# Altium schematic sheet CAN.SchDoc
size A4; SheetNumber: 16; SheetTotal: 29
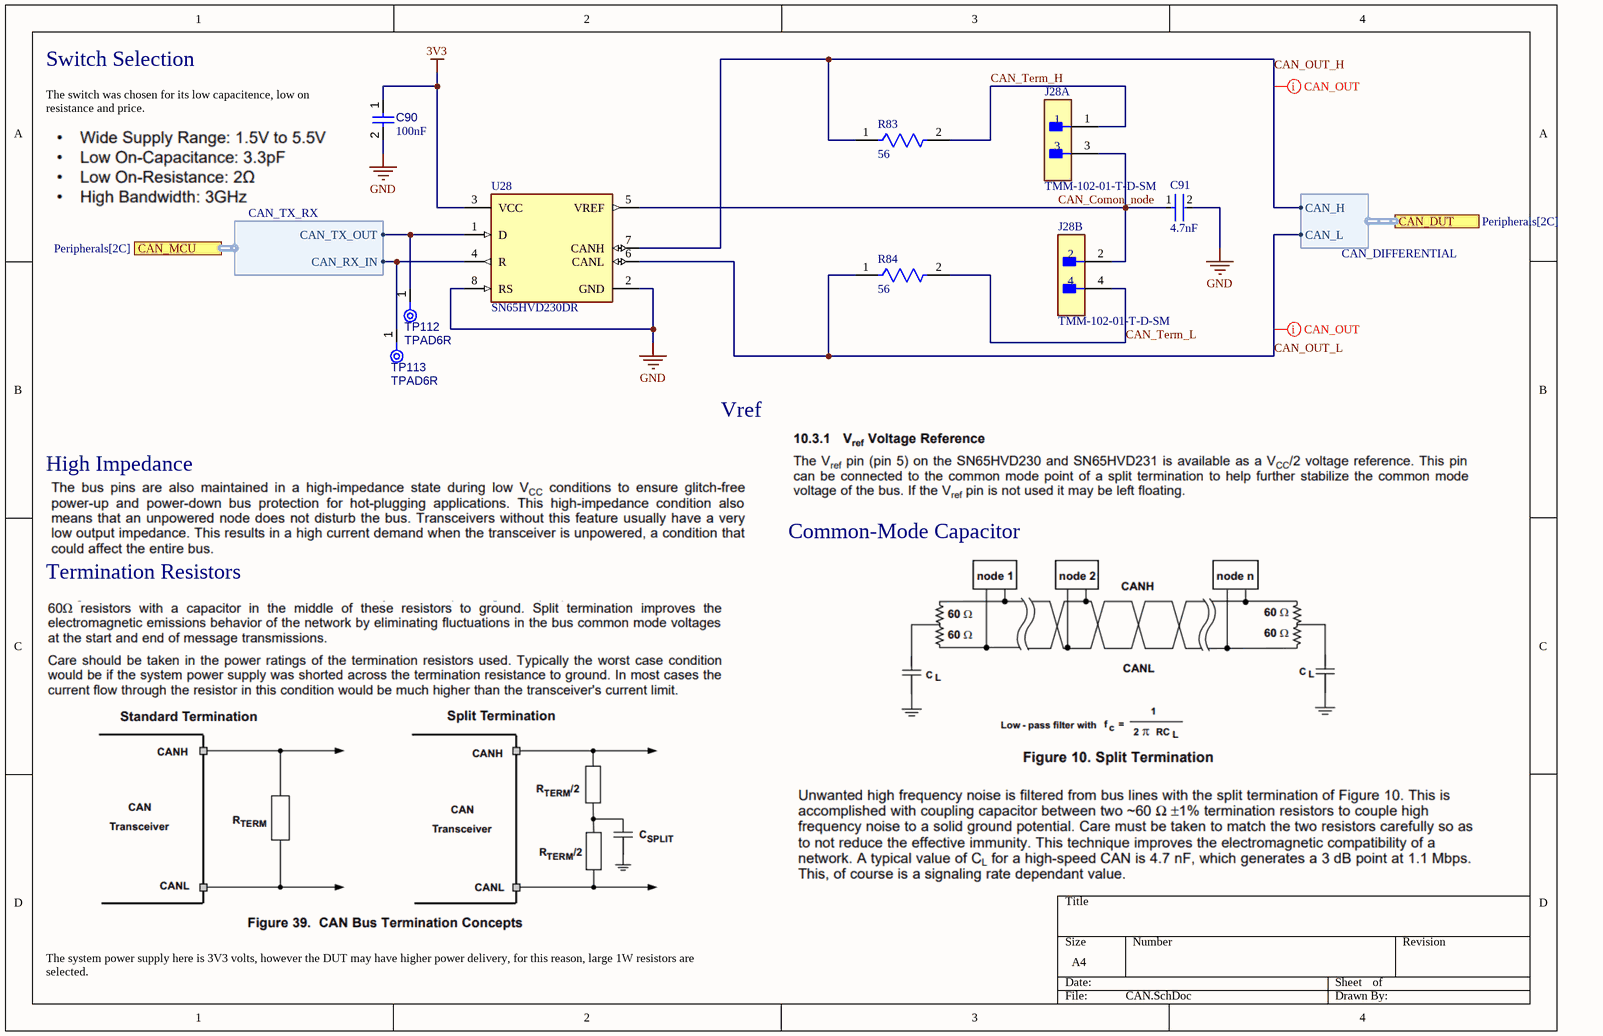
[diagram p0: CAN.SchDoc]

## Parts
C90  value 100nF  [CAPC1608X90X40NL10T20]  (hidden comment: Capacitor 100 nF +/-10% 50 V 0603)
C91  value 4.7nF  [FP-C0603C-CF-MFG]  (hidden comment: C0603C472K3GACTU)
J28  TMM-102-01-T-D-SM  [FP-TMM-102-01-T-D-SM-MFG]  (parts A,B of 2)
R83  value 56  [FP-AC2512-IPC_C]  (hidden comment: AC2512FK-0756RL)
R84  value 56  [FP-AC2512-IPC_C]  (hidden comment: AC2512FK-0756RL)
TP112  TPAD6R  [TP06R]  (no BOM)
TP113  TPAD6R  [TP06R]  (no BOM)
U28  SN65HVD230DR  [FP-D0008A-IPC_A]

## Ports
CAN_DUT (harness CAN_DIFFERENTIAL, see Peripherals[2C]), CAN_MCU (harness CAN_TX_RX, see Peripherals[2C])

## Harnesses
CAN_DIFFERENTIAL: CAN_H, CAN_L
CAN_TX_RX: CAN_TX_OUT, CAN_RX_IN

## Nets
3V3: C90.1 U28.3(VCC)
GND: C90.2 C91.2 U28.2(GND) U28.8(RS)
CAN_Comon_node: C91.1 J28.2 J28.3 U28.5(VREF)
CAN_OUT_H: R83.1 U28.7(CANH) ; port CAN_DUT.CAN_H
CAN_OUT_L: R84.1 U28.6(CANL) ; port CAN_DUT.CAN_L
CAN_Term_H: J28.1 R83.2
CAN_Term_L: J28.4 R84.2
NetTP112_1: TP112.1(TP) U28.1(D) ; port CAN_MCU.CAN_TX_OUT
NetTP113_1: TP113.1(TP) U28.4(R) ; port CAN_MCU.CAN_RX_IN

## Layout directives
differential pair; differential pair class CAN_DIFF_PAIR: CAN_OUT_H
differential pair: CAN_OUT_L

## Notes on the sheet
- Switch Selection
- The switch was chosen for its low capacitence, low on resistance and price.
- Vref
- High Impedance
- Termination Resistors
- Common-Mode Capacitor
- The system power supply here is 3V3 volts, however the DUT may have higher power delivery, for this reason, large 1W resistors are selected.

## Library data of the parts
C90 = CMP-001-00017-6: Chip Capacitor, 100 nF, +/- 10%, 50 V, 0603 (1608 Metric); Voltage Rating: 50V; Capacitor Type: Ceramic; Tolerance: 10%; Mounting Technology: SM; Max Operating Temperature: 125°C; RoHS Compliant: True; Pins: 2; Case/Package: 0603; Min Operating Temperature: -55°C
C91 = CMP-001-00135-1: Ceramic Capacitor, Multilayer, Ceramic, 25V, 10% +Tol, 10% -Tol, C0G, 30Ppm/Cel Tc, 0.0047Uf,; Dissipation Factor: 0.1%; Temperature Coefficient: 30ppm/°C; Material: Ceramic; Height: 800µm; Max Operating Temperature: 125°C; Introduction Date: 2008-06-06; Export Control Classification Number (ECCN) Code: EAR99; Mounting Technology: Surface Mount; RoHS: Compliant; Case/Package: 0603; Min Operating Temperature: -55°C; Voltage Rating (DC): 25V; Voltage Rating: 25V; Tolerance: 10%; China RoHS: Compliant; Dielectric Material: Ceramic; Width: 800µm; Lead Free: Lead Free; Schedule B: 8532240020, 8532240020; Harmonized Tariff Schedule (HTS) Code: 8532.24.00.20; Country of Origin: Mexico; Termination: SMD/SMT; Lifecycle Status: Production; Length: 1.6mm; Number of Terminals: 2; REACH SVHC: Yes; Case Code (Metric): 1608; Dielectric: C0G; Case Code (Imperial): 0603
J28 = CMP-02766-001755-1: CONN HEADER SMD 4POS 2MM; Gender: Male; Row Spacing: 0.079inch; Max Current Rating: 3.9A; Max Voltage Rating (AC): 500V; Number of Positions: 4; Lead Free: Lead Free; Insulation Material: Polymer; Contact Finish - Mating: TIN; Length: 4mm; RoHS Compliant: Yes; Housing Color: Black; Flammability Rating: UL94 V-0; Mount: Surface Mount; Number of Rows: 2; Housing Material: Polymer; Fastening Type: Pull; Termination: Solder; Max Operating Temperature: 105°C; Min Operating Temperature: -55°C; Contact Mating Length: 0.126inch; Series: TMM; Radiation Hardening: No; REACH SVHC: No SVHC; Pitch: 2mm; Color: Black; Connector Type: Header; Package Quantity: 1; Width: 3.94mm; Contact Material: Bronze; Packaging: Bulk; Contact Type: Male Pin; Orientation: Straight; Contact Plating: Tin; Depth: 3.94mm; Contact Shape: Square; Insulation Color: Black; Number of Contacts: 4
R83 R84 = CMP-009-00355-1: 1W Thick Film Resistors 200V ±100ppm/℃ ±1% 56Ω 2512 Chip Resistor - Surface Mount ROHS; Temperature Coefficient: 100ppm/°C; Width: 3.1mm; RoHS: Compliant; Voltage Rating: 200V; Lifecycle Status: Production; Max Power Dissipation: 1W; Features: Automotive AEC-Q200, Moisture Resistant; Height: 550µm; Number of Terminations: 2; Mounting Technology: Surface Mount; Ratings: AEC-Q200; China RoHS: Non-Compliant; Length: 6.35mm; Min Operating Temperature: -55°C; Power Rating: 1W; Working Voltage: 200V; Tolerance: 1%; Composition: Thick Film; Case/Package: 2512; Number of Terminals: 2; Max Operating Temperature: 155°C; REACH SVHC: Yes
TP112 TP113 = CMP-00028-00002-2: 0.6mm round; Pins: 1
U28 = CMP-015-00012-1: 3.3 V CAN Transceiver with Standby Mode 8-SOIC -40 to 85; Manufacturer Lifecycle Status: ACTIVE; Number of Transceivers: 1; Max Supply Voltage: 3.6V; Data Rate: 1Mbps; Slew Rate: 15V/µs; Number of I/Os: 2; Operating Supply Voltage: 3.3V; Min Supply Voltage: 3V; Nominal Supply Current: 370µA; Max Supply Current: 17mA; RoHS: Compliant; Radiation Hardening: No; Number of Receive Buffers: 1; Contact Plating: Gold; Case/Package: SOIC; Width: 3.91mm; Weight: 72.603129mg; Packaging: Cut Tape; Number of Receivers: 1; Max Operating Temperature: 85°C; Lifecycle Status: Production; Schedule B: 8542390000, 8542390000; Length: 4.9mm; Height: 1.75mm; Thickness: 1.58mm; Lead Free: Lead Free; Termination: SMD/SMT; Ambient Temperature Range High: 85°C; Pins: 8; Min Operating Temperature: -40°C; Number of Transmit Buffers: 1; REACH SVHC: No; Number of Drivers: 1; Interface: CAN